# EAGLE design AS5048A_ext (EAGLE 9.4.1)
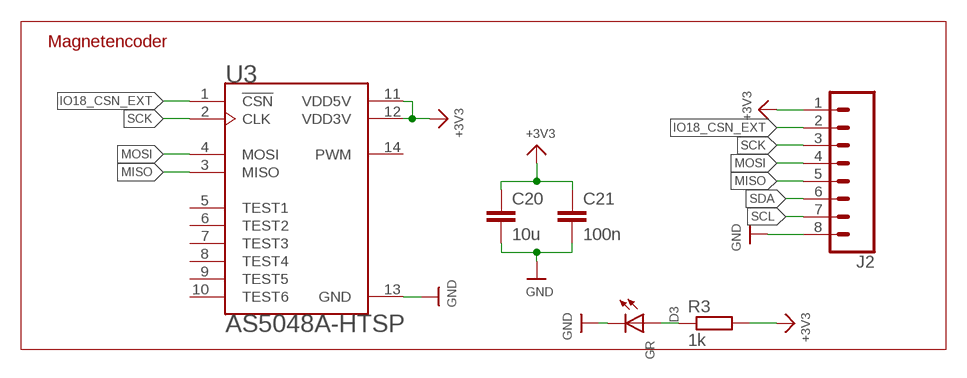
[diagram p0: schematic, sheet 1]

## Parts
C20  10u  C-EUC0805  [C0805]
C21  100n  C-EUC0805  [C0805]
D3  GR  LEDCHIP-LED0805  [CHIP-LED0805]
J2  CONN_08BM08B-SRSS-TB  [BM08B-SRSS-TB]
R3  1k  R-EU_R0805  [R0805]
U3  AS5048A-HTSP  [SOP65P640X120-14N]

## Nets
+3V3: C20.1 C21.1 J2.1 R3.2 U3.11(VDD5V) U3.12(VDD3V)
GND: C20.2 C21.2 D3.C J2.8 U3.13(GND)
IO18_CSN_EXT: J2.2 U3.1(!CSN)
MISO: J2.5 U3.3(MISO)
MOSI: J2.4 U3.4(MOSI)
N$1: D3.A R3.1
SCK: J2.3 U3.2(CLK)
SCL: J2.7
SDA: J2.6
Unconnected: U3.5(TEST1) U3.6(TEST2) U3.7(TEST3) U3.8(TEST4) U3.9(TEST5) U3.10(TEST6) U3.14(PWM)

## Notes on the sheet
- Magnetencoder

## Library data of the parts
C20 C21 = rcl:C-EU: CAPACITOR, European symbol; SPICEPREFIX: C
D3 = led:LED: LED OSRAM: - CHIPLED LG R971, LG N971, LY N971, LG Q971, LY Q971, LO R971, LY R971 LH N974, LH R974 LS Q976, LO Q976, LY Q976 LO Q996 - Hyper CHIPLED LW Q18S LB Q993, LB Q99A, LB R99A - SideLED LS A670, LO A670, LY A670, LG A670, LP A670 LB A673, LV A673, LT A673, LW A673 LH A674 LY A675 LS A676, LA A676, LO A676, LY A676, LW A676 LS A679, LY A679, LG A679 - Hyper Micro SIDELED® LS Y876, LA Y876, LO Y876, LY Y876 LT Y87S - SmartLED LW L88C, LW L88S LB L89C, LB L89S, LG L890 LS L89K, LO L89K, LY L89K LS L896, LA L896, LO L896, LY L896 - TOPLED LS T670, LO T670, LY T670, LG T670, LP T670 LSG T670, LSP T670, LSY T670, LOP T670, LYG T670 LG T671, LOG T671, LSG T671 LB T673, LV T673, LT T673, LW T673 LH T674 LS T676, LA T676, LO T676, LY T676, LB T676, LH T676, LSB T676, LW T676 LB T67C, LV T67C, LT T67C, LS T67K, LO T67K, LY T67K, LW E67C LS E67B, LA E67B, LO E67B, LY E67B, LB E67C, LV E67C, LT E67C LW T67C LS T679, LY T679, LG T679 LS T770, LO T770, LY T770, LG T770, LP T770 LB T773, LV T773, LT T773, LW T773 LH T774 LS E675, LA E675, LY E675, LS T675 LS T776, LA T776, LO T776, LY T776, LB T776 LHGB T686 LT T68C, LB T68C - Hyper Mini TOPLED® LB M676 - Mini TOPLED Santana® LG M470 LS M47K, LO M47K, LY M47K Source: http://www.osram.convergy.de LUXEON: - LUMILED® LXK2-PW12-R00, LXK2-PW12-S00, LXK2-PW14-U00, LXK2-PW14-V00 LXK2-PM12-R00, LXK2-PM12-S00, LXK2-PM14-U00 LXK2-PE12-Q00, LXK2-PE12-R00, LXK2-PE12-S00, LXK2-PE14-T00, LXK2-PE14-U00 LXK2-PB12-K00, LXK2-PB12-L00, LXK2-PB12-M00, LXK2-PB14-N00, LXK2-PB14-P00, LXK2-PB14-Q00 LXK2-PR12-L00, LXK2-PR12-M00, LXK2-PR14-Q00, LXK2-PR14-R00 LXK2-PD12-Q00, LXK2-PD12-R00, LXK2-PD12-S00 LXK2-PH12-R00, LXK2-PH12-S00 LXK2-PL12-P00, LXK2-PL12-Q00, LXK2-PL12-R00 Source: www.luxeon.com KINGBRIGHT: KA-3528ASYC Source: www.kingbright.com
J2 = SparkFun-Connectors:CONN_08: Multi connection point. Often used as Generic Header-pin footprint for 0.1 inch spaced/style header connections On any of the 0.1 inch spaced packages, you can populate with these: Break Away Headers - Straight <https://www.sparkfun.com/products/116> (PRT-00116) Break Away Male Headers - Right Angle <https://www.sparkfun.com/products/553> (PRT-00553) Female Headers <https://www.sparkfun.com/products/115> (PRT-00115) Break Away Headers - Machine Pin <https://www.sparkfun.com/products/117> (PRT-00117) Break Away Female Headers - Swiss Machine Pin <https://www.sparkfun.com/products/743> (PRT-00743) Arduino Stackable Header - 8 Pin <https://www.sparkfun.com/products/9279> (PRT-09279) For SCREWTERMINALS and SPRING TERMINALS visit here: Screw Terimnals on SparkFun.com <https://www.sparkfun.com/search/results?term=Screw+Terminals> (5mm/3.5mm/2.54mm spacing) This device is also useful as a general connection point to wire up your design to another part of your project. Our various solder wires solder well into these plated through hole pads. Hook-Up Wire - Assortment (Stranded, 22 AWG) <https://www.sparkfun.com/products/11375> (PRT-11375) Hook-Up Wire - Assortment (Solid Core, 22 AWG) <https://www.sparkfun.com/products/11367> (PRT-11367) View the entire wire category on our website here <https://www.sparkfun.com/categories/141> Special notes: Molex polarized connector foot print use with SKU : PRT-08231 with associated crimp pins and housings. 1MM SMD Version SKU: PRT-10208 NOTES ON THE VARIANTS LOCK and LOCK_LONGPADS... This footprint was designed to help hold the alignment of a through-hole component (i.e. 6-pin header) while soldering it into place. You may notice that each hole has been shifted either up or down by 0.005 of an inch from it's more standard position (which is a perfectly straight line). This slight alteration caused the pins (the squares in the middle) to touch the edges of the holes. Because they are alternating, it causes a "brace" to hold the component in place. 0.005 has proven to be the perfect amount of "off-center" position when using our standard breakaway headers. Although looks a little odd when you look at the bare footprint, once you have a header in there, the alteration is very hard to notice. Also,if you push a header all the way into place, it is covered up entirely on the bottom side.; PROD_ID: CONN-10556
R3 = rcl:R-EU_: RESISTOR, European symbol; SPICEPREFIX: R
U3 = AS5048A-HTSP:AS5048A-HTSP: AS5048B Series 360° 3.3 / 5 V 14 bit Magnetic Rotary Encoder - TSSOP-14; AVAILABILITY: Unavailable; DESCRIPTION: Ic Encoder Rotary 14-Tssop; MF: ams; MP: AS5048A-HTSP; PACKAGE: TSSOP-14 ams; PRICE: None

## Board
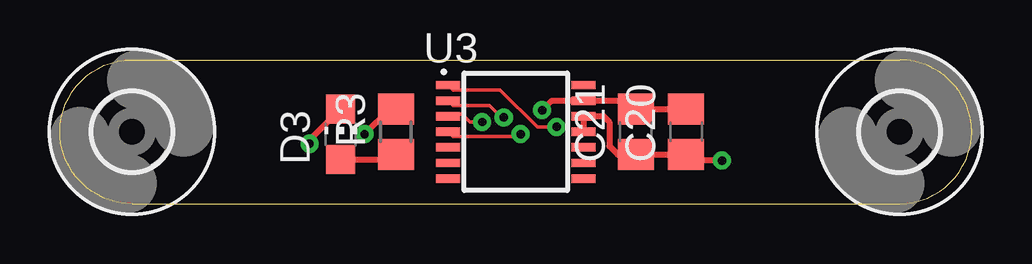
[diagram p1: board, top side]
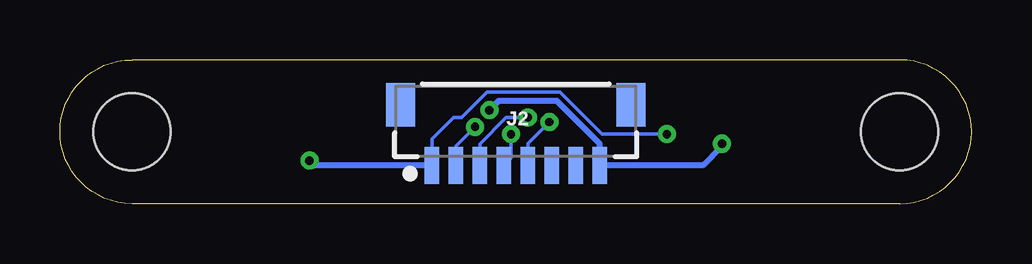
[diagram p2: board, bottom side, seen from below]

Size 38 x 6 mm. Coordinates in mm from the lower left corner, seen from the top.
Outline: 3,0 35,0 arc180 35,6 3,6 arc180 3,0
Copper layers (1*16): Top 0.035mm / dielectric 1.5mm / Bottom 0.035mm
Design rules "default *": minimum track width 6mil, minimum drill 0.35mm, track to track 6mil, track to pad 6mil, pad to pad 6mil, via to via 6mil, smd to smd 6mil, copper to edge 40mil, drill to drill 6mil, minimum pad ring 10mil, minimum via ring 8mil, stop-mask expansion 4mil, vias tented up to drill 0.5mm, thermal gap 10mil

### Footprints (pad centres in the part's own frame; a part is rotated, then mirrored left to right if it is on the bottom)
C0805 = smd 1.3 x 1.5: 1 -0.95,0; 2 0.95,0
CHIP-LED0805 = smd 1.2 x 1.2: A 0,-1.05; C 0,1.05
BM08B-SRSS-TB = smd 0.6 x 1.55: 1 -3.5,0; 2 -2.5,0; 3 -1.5,0; 4 -0.5,0; 5 0.5,0; 6 1.5,0; 7 2.5,0; 8 3.5,0 | smd 1.2 x 1.8: P$9 4.8,2.525; P$10 -4.8,2.525
R0805 = smd 1.3 x 1.5: 1 -0.95,0; 2 0.95,0
SOP65P640X120-14N = smd 1 x 0.35: 1 -2.825,1.95; 2 -2.825,1.3; 3 -2.825,0.65; 4 -2.825,0; 5 -2.825,-0.65; 6 -2.825,-1.3; 7 -2.825,-1.95; 8 2.825,-1.95; 9 2.825,-1.3; 10 2.825,-0.65; 11 2.825,0; 12 2.825,0.65; 13 2.825,1.3; 14 2.825,1.95
3,2 = hole 3.2: 0,0

### Placement (x,y rotation side)
C20  26.1,3 90 top
C21  24,3 90 top
D3  11.7,2.9 0 top
J2  19,1.6 0 bottom
R3  14,3 90 top
U3  19,3 0 top
U$1  [3,2]  3,3 0 top
U$2  [3,2]  35,3 0 top

### Tracks (layer width: path | path; a pad name or v marks a point on that pad's centre or on a via)
+3V3  (via drill 0.35)
  Top 0.254: U3.11 U3.12 22.65,3.65 22.9,3.4 22.9,2.4 23.25,2.05 C21.1 C20.1 26.35,1.8 v27.6,1.8 | R3.2 13.75,3.95 v12.7,2.9
  Bottom 0.152: J2.1 22.5,2.7 21.6,3.6 21.26,3.6 20.2,4.66 17.15,4.66 15.4,2.9 v12.7,2.9
  Bottom 0.254: J2.1 27.4,1.6 v27.6,1.8
GND  (via drill 0.35)
  Top 0.254: v20.1,3.9 20.5,4.3 U3.13 23.65,4.3 C21.2 C20.2 | D3.C 10.4,2.65 v10.4,2.5
  Bottom 0.254: v20.1,3.9 19.7,4.3 17.3,4.3 15.5,2.5 J2.8 11.2,1.6 10.4,2.4 v10.4,2.5
IO18_CSN_EXT  (via drill 0.35)
  Top 0.152: U3.1 16.38,4.75 18.35,4.75 19.9,3.2 v20.7,3.2
  Bottom 0.152: J2.2 21.5,2.4 v20.7,3.2
MISO  (via drill 0.35)
  Top 0.152: U3.3 16.27,3.75 16.76,3.75 17.1,3.41 v17.6,3.41
  Bottom 0.152: v17.6,3.41 18.5,2.51 J2.5
MOSI  (via drill 0.35)
  Top 0.152: v19.2,2.9 19.1,2.8 16.38,2.8 U3.4
  Bottom 0.152: v19.2,2.9 19.2,1.9 J2.4
N$1
  Top 0.254: D3.A 13.8,1.85 R3.1
SCK  (via drill 0.35)
  Top 0.152: v18.5,3.6 18.4,3.6 17.9,4.1 16.38,4.1 U3.2
  Bottom 0.152: J2.3 20.5,2.5 19.4,3.6 v18.5,3.6